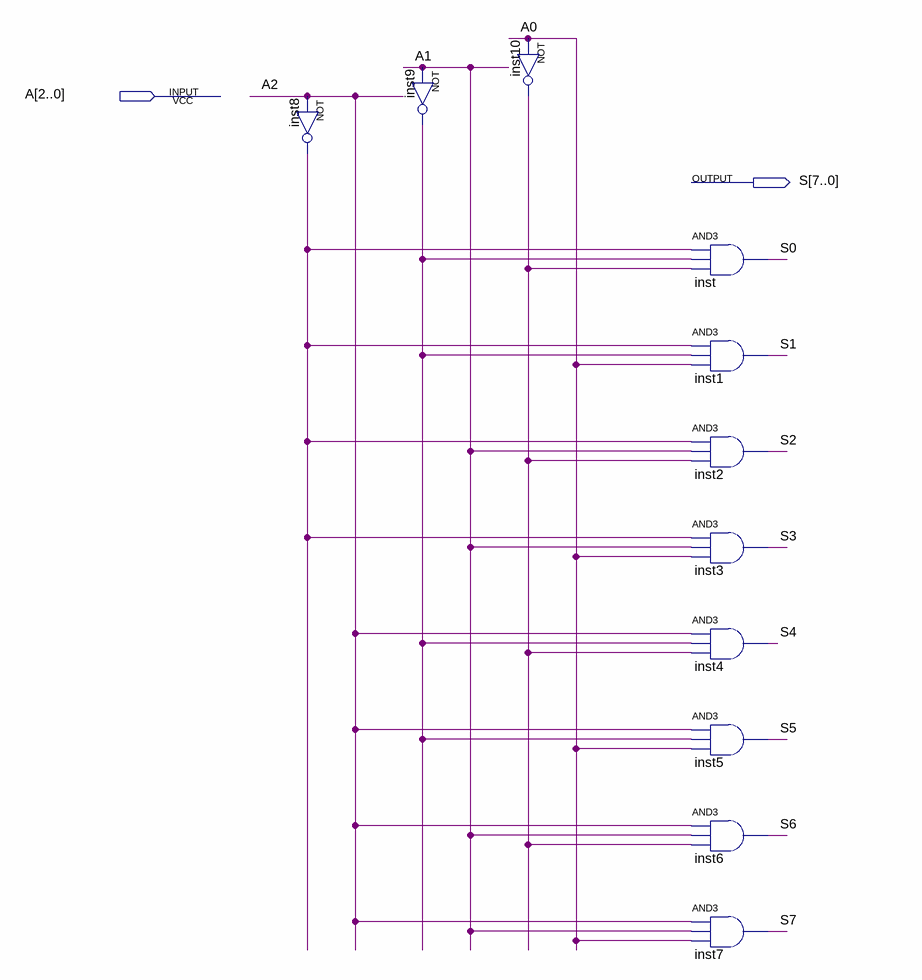
[diagram p0: schematic sheet]
// Quartus schematic decod3x8.bdf as structural Verilog: 11 symbols, 2 pins
module decod3x8 (
  input  [2:0] A,
  output [7:0] S
);

  wire inst8_out, inst9_out, inst10_out;

  not inst8 (inst8_out, A[2]);
  not inst9 (inst9_out, A[1]);
  not inst10 (inst10_out, A[0]);
  and inst (S[0], inst8_out, inst9_out, inst10_out);
  and inst1 (S[1], inst8_out, inst9_out, A[0]);
  and inst2 (S[2], inst8_out, A[1], inst10_out);
  and inst3 (S[3], inst8_out, A[1], A[0]);
  and inst4 (S[4], A[2], inst9_out, inst10_out);
  and inst5 (S[5], A[2], inst9_out, A[0]);
  and inst6 (S[6], A[2], A[1], inst10_out);
  and inst7 (S[7], A[2], A[1], A[0]);
endmodule
